# Altium schematic sheet XX_Power.SchDoc
size 840 x 594 mm; PageSetup: Record=PageOptions|CenterHorizontal=False|CenterVertical=False|PrintScale=0.95|XCorrection=0.00|YCorrection=0.00|PrintKind=1|BorderSize=5000000|LeftOffset=0|BottomOffset=0|Orientation=1|PaperLength=1000|PaperWidth=1000|Scale=100|PaperSource=15|PrintQuality=600|MediaType=1|DitherType=10|PaperKind=A4|PrintScaleMode=1; ESKD_Decimal_Number: {XXXX.XXXXXX.XXX}; ESKD_Document_Name: {Наименование документа}; ESKD_Pervichnoe_Primenenie: {Первичное наименование}; ESKD_T_Kontr: {Т.Контр}; ESKD_N_Kontr: {Н.Контр}; ESKD_Utverdil: {Утвердил}; ESKD_Organizaciya: {Организация}; ESKD_Proveril: {Проверил}; ESKD_Razrabotal: {Разработал}; Address1: Address1; Address2: Address2; Address3: Address3; Address4: Address4; DocumentNumber: АБВГ.123456.001 Э3; SheetNumber: 4; SheetTotal: 7; Scale: 1:1; DocumentType: Схема электрическая принципиальная; FirstReferrence: АБВГ.123456.001
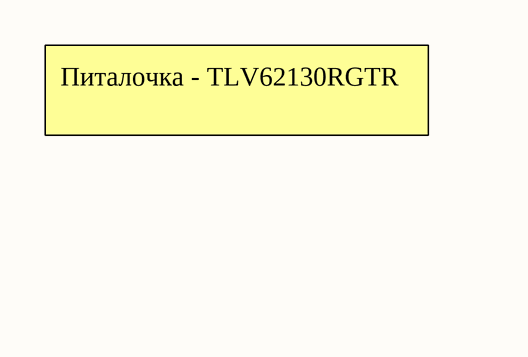
[diagram p0: XX_Power.SchDoc]

## Notes on the sheet
- Питалочка - TLV62130RGTR
- Перв. примен.
- Справ. №
- Подп. и дата
- Инв. № дубл.
- Взам. инв. №
- Инв. № подл.
- Изм.
- Лист
- № докум.
- Подп.
- Дата
- 2.106-A2
- Копировал
- Формат А1